# Altium schematic sheet Sheet1.SchDoc
size A4
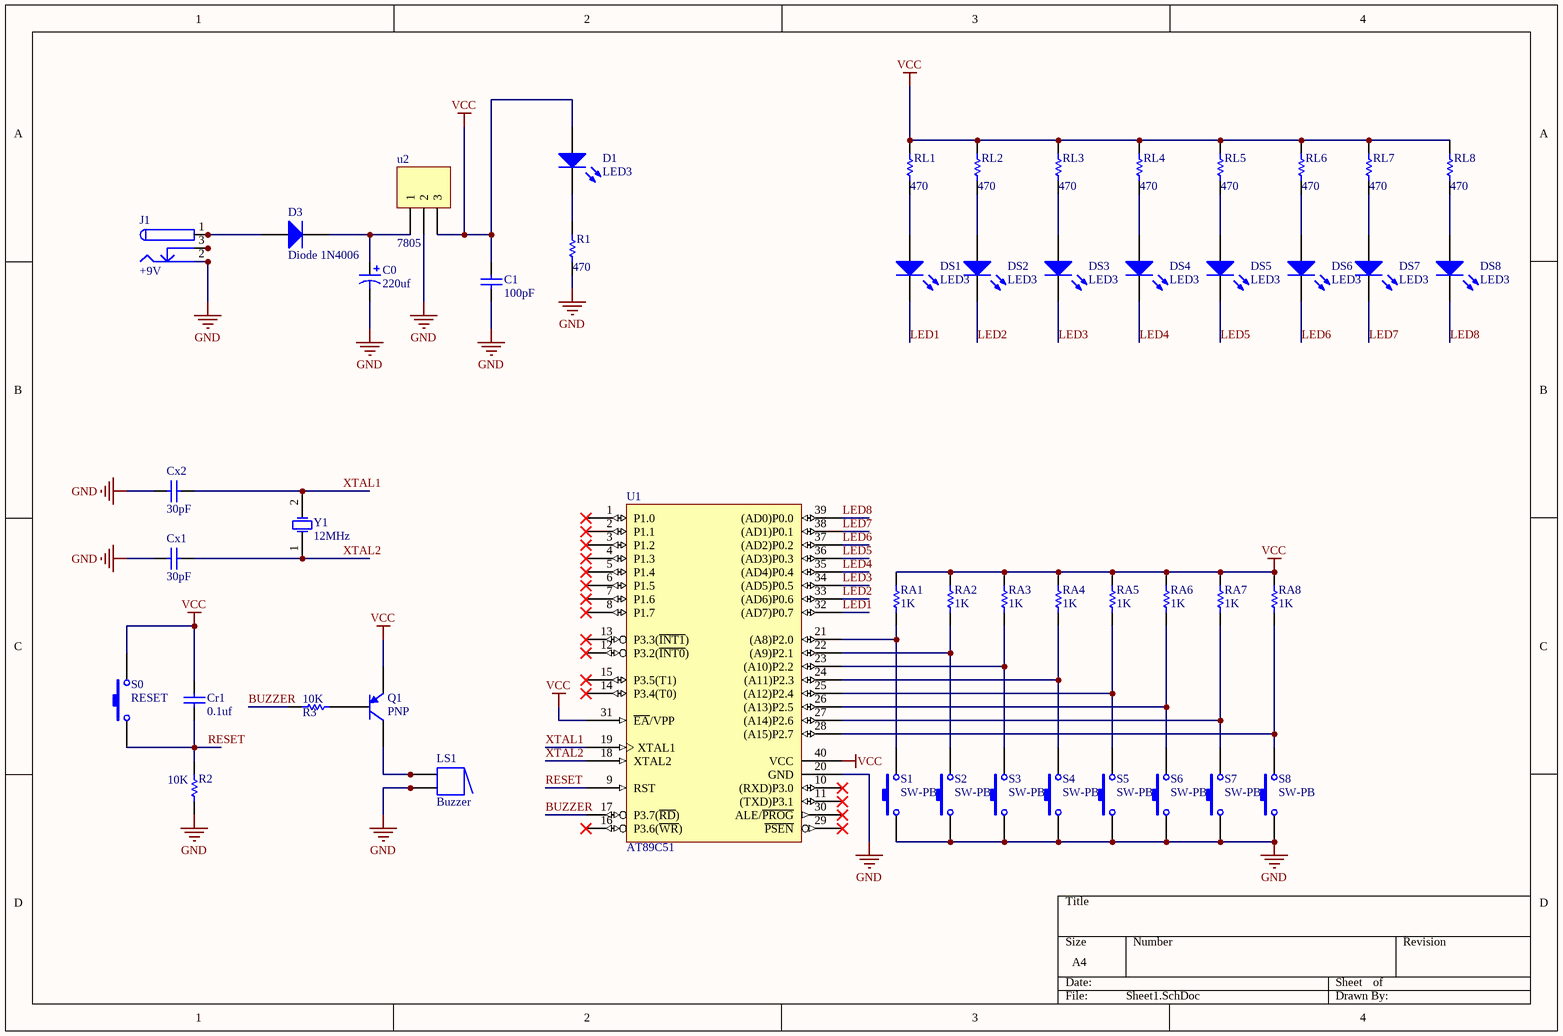
[diagram p0: Sheet1.SchDoc]

## Parts
C0  value 220uf  [RB7.6-15]  (hidden comment: Cap Pol1)
C1  value 100pF  [RAD-0.3]  (hidden comment: Cap)
Cr1  value 0.1uf  [RAD-0.3]  (hidden comment: Cap)
Cx1  value 30pF  [RAD-0.3]  (hidden comment: Cap)
Cx2  value 30pF  [RAD-0.3]  (hidden comment: Cap)
D1  LED3  [3.5X2.8X1.9]
D3  Diode 1N4006  [DO-41]
DS1  LED3  [3.5X2.8X1.9]
DS2  LED3  [3.5X2.8X1.9]
DS3  LED3  [3.5X2.8X1.9]
DS4  LED3  [3.5X2.8X1.9]
DS5  LED3  [3.5X2.8X1.9]
DS6  LED3  [3.5X2.8X1.9]
DS7  LED3  [3.5X2.8X1.9]
DS8  LED3  [3.5X2.8X1.9]
J1  +9V  [KLD-0202]
LS1  Buzzer  [ABSM-1574]
Q1  PNP  [TO-92A]
R1  value 470  [AXIAL-0.3]  (hidden comment: Res1)
R2  value 10K  [AXIAL-0.3]  (hidden comment: Res1)
R3  value 10K  [AXIAL-0.3]  (hidden comment: Res1)
RA1  value 1K  [AXIAL-0.3]  (hidden comment: Res1)
RA2  value 1K  [AXIAL-0.3]  (hidden comment: Res1)
RA3  value 1K  [AXIAL-0.3]  (hidden comment: Res1)
RA4  value 1K  [AXIAL-0.3]  (hidden comment: Res1)
RA5  value 1K  [AXIAL-0.3]  (hidden comment: Res1)
RA6  value 1K  [AXIAL-0.3]  (hidden comment: Res1)
RA7  value 1K  [AXIAL-0.3]  (hidden comment: Res1)
RA8  value 1K  [AXIAL-0.3]  (hidden comment: Res1)
RL1  value 470  [AXIAL-0.3]  (hidden comment: Res1)
RL2  value 470  [AXIAL-0.3]  (hidden comment: Res1)
RL3  value 470  [AXIAL-0.3]  (hidden comment: Res1)
RL4  value 470  [AXIAL-0.3]  (hidden comment: Res1)
RL5  value 470  [AXIAL-0.3]  (hidden comment: Res1)
RL6  value 470  [AXIAL-0.3]  (hidden comment: Res1)
RL7  value 470  [AXIAL-0.3]  (hidden comment: Res1)
RL8  value 470  [AXIAL-0.3]  (hidden comment: Res1)
S0  RESET  [SPST-2]
S1  SW-PB  [SPST-2]
S2  SW-PB  [SPST-2]
S3  SW-PB  [SPST-2]
S4  SW-PB  [SPST-2]
S5  SW-PB  [SPST-2]
S6  SW-PB  [SPST-2]
S7  SW-PB  [SPST-2]
S8  SW-PB  [SPST-2]
U1  AT89C51  [DIP-40]
u2  7805  [HDR1X3H]
Y1  12MHz  [R38]

## Nets
GND: C0.2 C1.1 Cx1.1 Cx2.1 J1.2 J1.2A J1.2B LS1.2 LS1.2A R1.1 R2.1 S1.1 S2.1 S3.1 S4.1 S5.1 S6.1 S7.1 S8.1 U1.20(GND) u2.2
VCC: C1.2 Cr1.2 D1.1(A) Q1.1(E) RA1.2 RA2.2 RA3.2 RA4.2 RA5.2 RA6.2 RA7.2 RA8.2 RL1.2 RL2.2 RL3.2 RL4.2 RL5.2 RL6.2 RL7.2 RL8.2 S0.2 U1.31(~{EA}/VPP) U1.40(VCC) u2.3
BUZZER: R3.1 U1.17(P3.7(~{RD}))
LED1: DS1.2(K) U1.32((AD7)P0.7)
LED2: DS2.2(K) U1.33((AD6)P0.6)
LED3: DS3.2(K) U1.34((AD5)P0.5)
LED4: DS4.2(K) U1.35((AD4)P0.4)
LED5: DS5.2(K) U1.36((AD3)P0.3)
LED6: DS6.2(K) U1.37((AD2)P0.2)
LED7: DS7.2(K) U1.38((AD1)P0.1)
LED8: DS8.2(K) U1.39((AD0)P0.0)
RESET: Cr1.1 R2.2 S0.1 U1.9(RST)
XTAL1: Cx2.2 U1.19(XTAL1) Y1.2(OSC2)
XTAL2: Cx1.2 U1.18(XTAL2) Y1.1(OSC1)
NetC0_1: C0.1 D3.2(K) u2.1
NetD1_2: D1.2(K) R1.2
NetD3_1: D3.1(A) J1.1 J1.1A J1.1B
NetDS1_1: DS1.1(A) RL1.1
NetDS2_1: DS2.1(A) RL2.1
NetDS3_1: DS3.1(A) RL3.1
NetDS4_1: DS4.1(A) RL4.1
NetDS5_1: DS5.1(A) RL5.1
NetDS6_1: DS6.1(A) RL6.1
NetDS7_1: DS7.1(A) RL7.1
NetDS8_1: DS8.1(A) RL8.1
NetJ1_3: J1.3 J1.3A J1.3B
NetLS1_1: LS1.1 LS1.1A Q1.3(C)
NetQ1_2: Q1.2(B) R3.2
NetRA1_1: RA1.1 S1.2 U1.21((A8)P2.0)
NetRA2_1: RA2.1 S2.2 U1.22((A9)P2.1)
NetRA3_1: RA3.1 S3.2 U1.23((A10)P2.2)
NetRA4_1: RA4.1 S4.2 U1.24((A11)P2.3)
NetRA5_1: RA5.1 S5.2 U1.25((A12)P2.4)
NetRA6_1: RA6.1 S6.2 U1.26((A13)P2.5)
NetRA7_1: RA7.1 S7.2 U1.27((A14)P2.6)
NetRA8_1: RA8.1 S8.2 U1.28((A15)P2.7)

Not connected (* = marked no-connect by the designer): U1 1(P1.0)* 2(P1.1)* 3(P1.2)* 4(P1.3)* 5(P1.4)* 6(P1.5)* 7(P1.6)* 8(P1.7)* 10((RXD)P3.0)* 11((TXD)P3.1)* 12(P3.2(~{INT0}))* 13(P3.3(~{INT1}))* 14(P3.4(T0))* 15(P3.5(T1))* 16(P3.6(~{WR}))* 29(~{PSEN})* 30(ALE/~{PROG})*

## Library data of the parts
C0 = Cap Pol1: Polarized Capacitor (Radial); Published: 8-Jun-2000; LatestRevisionDate: 17-Jul-2002; LatestRevisionNote: Re-released for DXP Platform.; PackageReference: RB7.6-15; Publisher: Altium Limited; PackageDescription: Polarized Capacitor (Radial); 2 Leads
C1 Cr1 Cx1 Cx2 = Cap: Capacitor; Published: 8-Jun-2000; LatestRevisionDate: 17-Jul-2002; LatestRevisionNote: Re-released for DXP Platform.; PackageReference: RAD-0.3; Publisher: Altium Limited; PackageDescription: Radial Cap, Thru-Hole; 2 Leads; 0.3 in Pin Spacing
D1 DS1-DS8 = LED3: Typical BLUE SiC LED; Published: 8-Jun-2000; LatestRevisionDate: 17-Dec-2003; LatestRevisionNote: PCB Footprint replaced.; DatasheetVersion: 16-Apr-2002; PackageVersion: 16-Apr-2002; PackageReference: 3.5X2.8X1.9; Publisher: Altium Limited; PackageDescription: SM LED; 2 C-Bend Leads; Body 3.5 x 2.8 x 1.9 mm, inc leads (LxWxH typ)
D3 = Diode 1N4006: 1 Amp General Purpose Rectifier; Published: 8-Jun-2000; LatestRevisionDate: 17-Jul-2002; LatestRevisionNote: Re-released for DXP Platform.; DatasheetVersion: 1998; PackageVersion: Aug-1999; PackageReference: DO-41; Publisher: Altium Limited; PackageDescription: Diode, Axial; Body 5.2 x 2.7 mm (LxDia. max), Lead Dia. 0.86 mm (max); Code_JEDEC: DO-204-AL; ComponentLink1Description: Manufacturer Link; ComponentLink1URL: http://www.fairchildsemi.com/; ComponentLink2Description: Datasheet; ComponentLink2URL: http://www.fairchildsemi.com/ds/1N%2F1N4001.pdf
J1 = PWR2.5: Low Voltage Power Supply Connector; Published: 17-Dec-2003; DatasheetDocument: 09-May-2002; Publisher: Altium Limited; ComponentLink1Description: Manufacturer Link; ComponentLink1URL: http://domino.kycon.com/internet/Products.html
LS1 = Buzzer: Magnetic Transducer Buzzer; Published: 24-Mar-1999; LatestRevisionDate: 17-Dec-2003; LatestRevisionNote: Schematic revised, PCB Footprint replaced.; DatasheetVersion: 17-Dec-2003; PackageReference: ABSM-1574; Publisher: Altium Limited; PackageDescription: Magnetic Transducer Buzzer; ComponentLink1Description: Manufacturer Link; ComponentLink1URL: http://www.megastar.com/linecard/buzzmode/index.php
Q1 = 2N3906: PNP General Purpose Amplifier; Published: 8-Jun-2000; LatestRevisionDate: 15-Jan-2003; LatestRevisionNote: PCB Footprint 'BCY-W3/D4.7' replaced; DatasheetVersion: 1997; PackageVersion: Sep-1998; PackageReference: TO-92A; Publisher: Altium Limited; PackageDescription: TO, Flat Index; 3 In-Line, Axial Leads; Body Dia. 4.5mm; Leads 0.51 x 0.48 mm (max); ComponentLink1Description: Manufacturer Link; ComponentLink1URL: http://www.fairchildsemi.com/; ComponentLink2Description: Datasheet; ComponentLink2URL: http://www.fairchildsemi.com/ds/2N%2F2N3906.pdf
R1-R3 RA1-RA8 RL1-RL8 = Res1: Resistor; Published: 8-Jun-2000; LatestRevisionDate: 17-Jul-2002; LatestRevisionNote: Re-released for DXP Platform.; PackageReference: AXIAL-0.3; Publisher: Altium Limited; PackageDescription: Axial Device, Thru-Hole; 2 Leads; 0.3 in Pin Spacing
S0-S8 = SW-PB: Switch; Published: 24-Mar-1999; LatestRevisionDate: 17-Jul-2002; LatestRevisionNote: Re-released for DXP Platform.; PackageReference: SPST-2; Publisher: Altium Limited; PackageDescription: Switch; 2 Leads
U1 = AT89C51: 8-Bit Microcontroller with 4K Flash ROM
u2 = Header 3H: Header, 3-Pin, Right Angle; LatestRevisionDate: 17-Jul-2002; LatestRevisionNote: Re-released for DXP Platform.; Publisher: Altium Limited
Y1 = XTAL: Crystal Oscillator; Published: 8-Jun-2000; LatestRevisionDate: 17-Jul-2002; LatestRevisionNote: Re-released for DXP Platform.; PackageReference: R38; Publisher: Altium Limited; PackageDescription: Crystal, Thru-Hole; 2 Leads; Body 3.1 x 8.2 mm (Dia.xH)